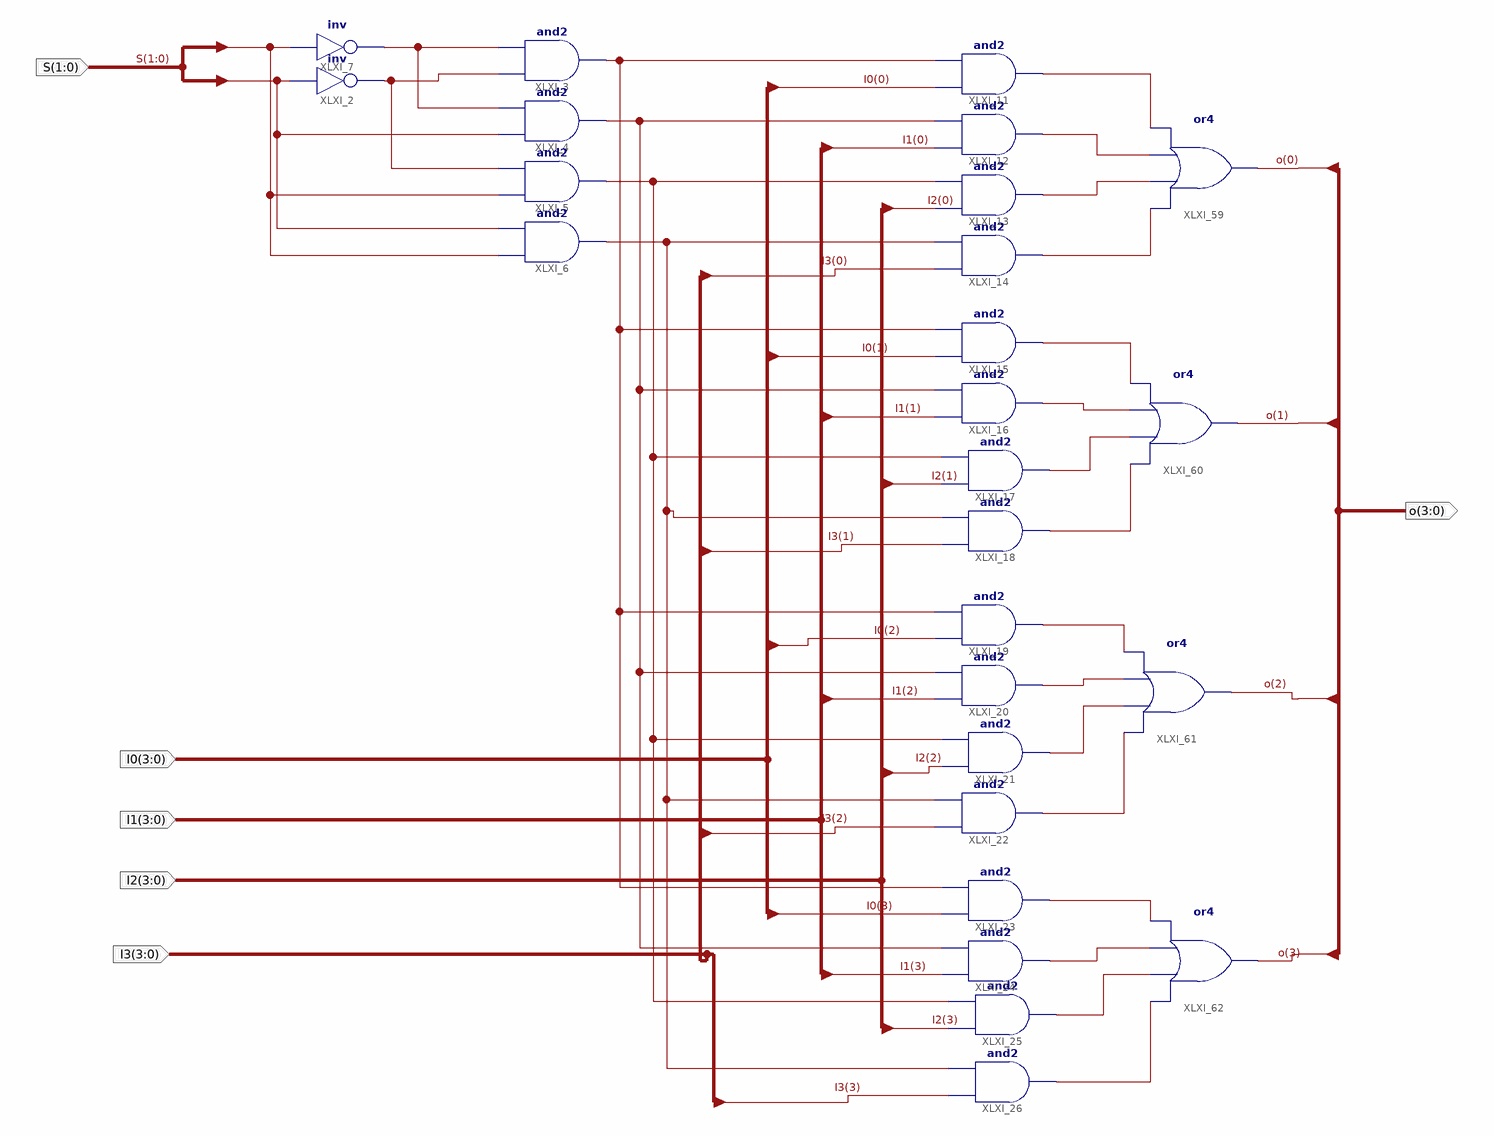
[diagram p0: schematic sheet 1]
// Xilinx ISE schematic Mux4T1_4.sch (kintex7) as structural Verilog: 26 symbols, 6 ports
module Mux4T1_4 (
  input  [3:0] I0,
  input  [3:0] I1,
  input  [3:0] I2,
  input  [3:0] I3,
  input  [1:0] S,
  output [3:0] o
);

  wire XLXN_7, XLXN_8, XLXN_18, XLXN_20, XLXN_29, XLXN_41, XLXN_107, XLXN_108, XLXN_112, XLXN_113, XLXN_115,
       XLXN_120, XLXN_121, XLXN_122, XLXN_123, XLXN_124, XLXN_126, XLXN_127, XLXN_128, XLXN_129, XLXN_130,
       XLXN_131;

  not XLXI_2 (XLXN_8, S[0]);
  and XLXI_3 (XLXN_18, XLXN_8, XLXN_7);
  and XLXI_4 (XLXN_20, S[0], XLXN_7);
  and XLXI_5 (XLXN_29, S[1], XLXN_8);
  and XLXI_6 (XLXN_41, S[1], S[0]);
  not XLXI_7 (XLXN_7, S[1]);
  and XLXI_26 (XLXN_131, I3[3], XLXN_41);
  and XLXI_25 (XLXN_130, I2[3], XLXN_29);
  and XLXI_24 (XLXN_129, I1[3], XLXN_20);
  and XLXI_23 (XLXN_128, I0[3], XLXN_18);
  and XLXI_22 (XLXN_126, I3[2], XLXN_41);
  and XLXI_21 (XLXN_127, I2[2], XLXN_29);
  and XLXI_20 (XLXN_124, I1[2], XLXN_20);
  and XLXI_19 (XLXN_123, I0[2], XLXN_18);
  and XLXI_18 (XLXN_122, I3[1], XLXN_41);
  and XLXI_17 (XLXN_121, I2[1], XLXN_29);
  and XLXI_16 (XLXN_120, I1[1], XLXN_20);
  and XLXI_15 (XLXN_115, I0[1], XLXN_18);
  and XLXI_14 (XLXN_113, I3[0], XLXN_41);
  and XLXI_13 (XLXN_112, I2[0], XLXN_29);
  and XLXI_12 (XLXN_108, I1[0], XLXN_20);
  and XLXI_11 (XLXN_107, I0[0], XLXN_18);
  or XLXI_59 (o[0], XLXN_113, XLXN_112, XLXN_108, XLXN_107);
  or XLXI_60 (o[1], XLXN_122, XLXN_121, XLXN_120, XLXN_115);
  or XLXI_61 (o[2], XLXN_126, XLXN_127, XLXN_124, XLXN_123);
  or XLXI_62 (o[3], XLXN_131, XLXN_130, XLXN_129, XLXN_128);
endmodule
